# Altium schematic sheet Switches.SchDoc
size A4
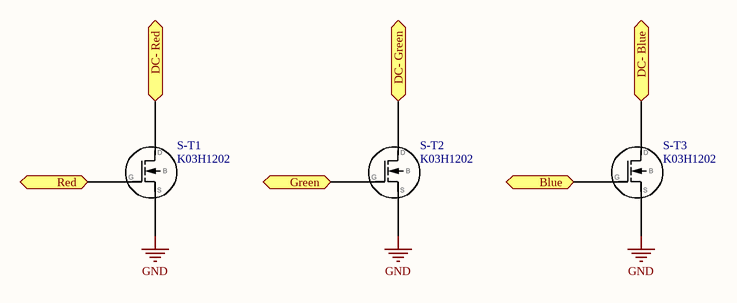
[diagram p0: Switches.SchDoc]

## Parts
S-T1  K03H1202  [TO-220-AB]
S-T2  K03H1202  [TO-220-AB]
S-T3  K03H1202  [TO-220-AB]

## Ports
Blue (in), DC- Blue (in), DC- Green (in), DC- Red (in), Green (in), Red (in)

## Nets
GND: S-T1.S S-T2.S S-T3.S
Blue: S-T3.G ; port Blue
DC- Blue: S-T3.D ; port DC- Blue
DC- Green: S-T2.D ; port DC- Green
DC- Red: S-T1.D ; port DC- Red
Green: S-T2.G ; port Green
Red: S-T1.G ; port Red

## Library data of the parts
S-T1-S-T3 = FET N-Channel: Enhancement Type; pin to pad: D>2 G>1 S>3